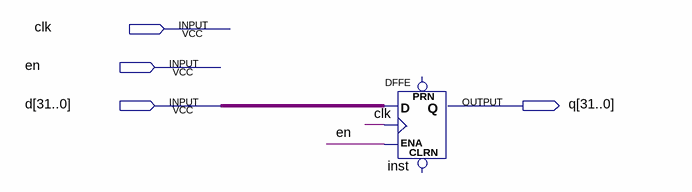
[diagram p0: schematic sheet]
// Quartus schematic reg32.bdf as structural Verilog: 1 symbols, 4 pins
module reg32 (
  input  clk,
  input  en,
  input  [31:0] d,
  output [31:0] q
);

  DFFE inst[31:0] (.D(d), .CLK(clk), .ENA(en), .Q(q));  // open: PRN, CLRN
endmodule
